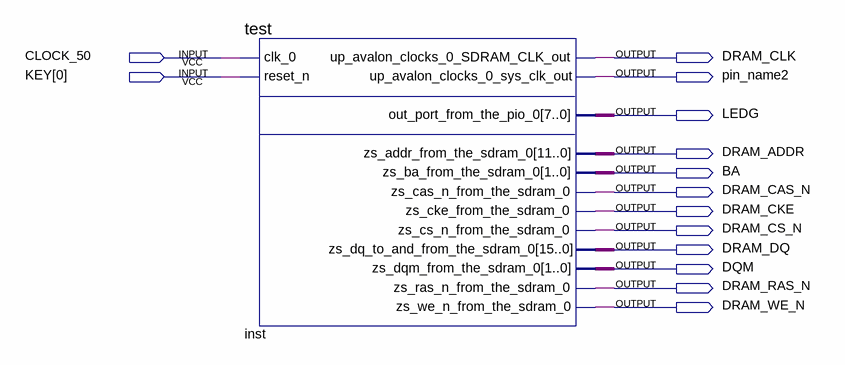
[diagram p0: schematic sheet]
// Quartus schematic NIOS2.bdf as structural Verilog: 1 symbols, 14 pins
module NIOS2 (
  input  CLOCK_50,
  input  [0:0] KEY,
  output DRAM_CLK,
  output pin_name2,
  output LEDG,
  output DRAM_ADDR,
  output BA,
  output DRAM_CAS_N,
  output DRAM_CKE,
  output DRAM_CS_N,
  output DRAM_DQ,
  output DQM,
  output DRAM_RAS_N,
  output DRAM_WE_N
);

  wire [1:0] inst_zs_ba_from_the_sdram_0, inst_zs_dqm_from_the_sdram_0;
  wire [7:0] inst_out_port_from_the_pio_0;
  wire [11:0] inst_zs_addr_from_the_sdram_0;
  wire [15:0] inst_zs_dq_to_and_from_the_sdram_0;

  test inst (
    .clk_0(CLOCK_50), .reset_n(KEY[0]), .up_avalon_clocks_0_SDRAM_CLK_out(DRAM_CLK),
    .up_avalon_clocks_0_sys_clk_out(pin_name2), .out_port_from_the_pio_0(inst_out_port_from_the_pio_0),
    .zs_addr_from_the_sdram_0(inst_zs_addr_from_the_sdram_0),
    .zs_ba_from_the_sdram_0(inst_zs_ba_from_the_sdram_0), .zs_cas_n_from_the_sdram_0(DRAM_CAS_N),
    .zs_cke_from_the_sdram_0(DRAM_CKE), .zs_cs_n_from_the_sdram_0(DRAM_CS_N),
    .zs_dqm_from_the_sdram_0(inst_zs_dqm_from_the_sdram_0), .zs_ras_n_from_the_sdram_0(DRAM_RAS_N),
    .zs_we_n_from_the_sdram_0(DRAM_WE_N), .zs_dq_to_and_from_the_sdram_0(inst_zs_dq_to_and_from_the_sdram_0));
endmodule
